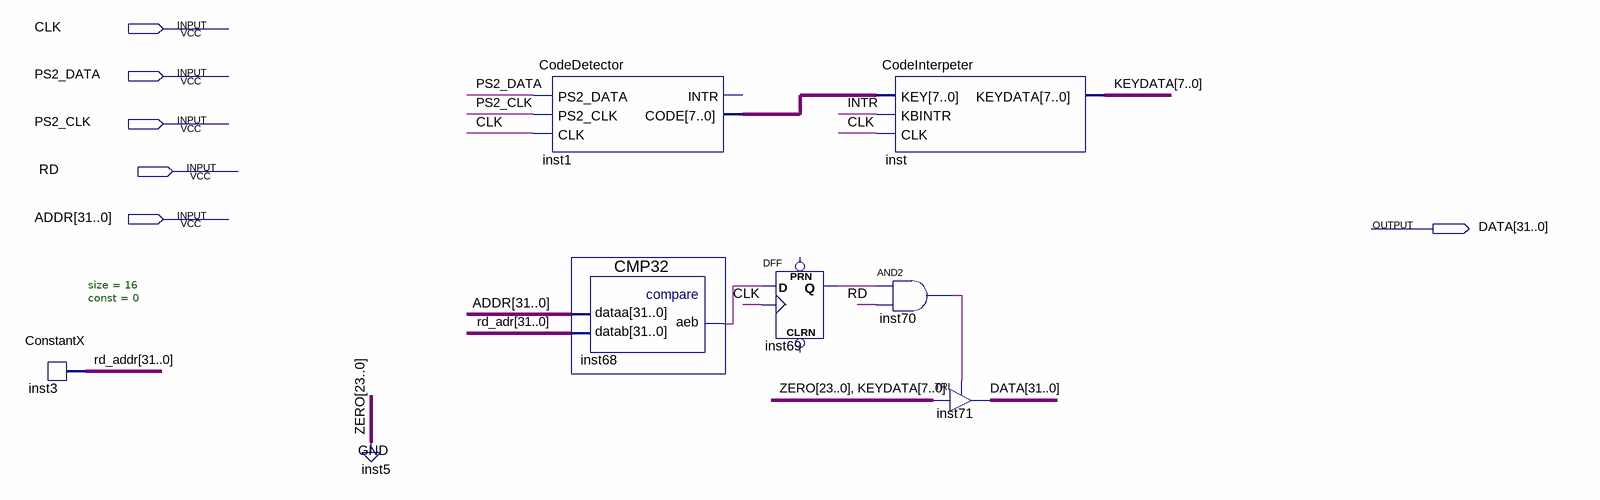
[diagram p0: schematic sheet]
// Quartus schematic KbController.bdf as structural Verilog: 7 symbols, 6 pins
module KbController (
  input  CLK,
  input  PS2_DATA,
  input  PS2_CLK,
  input  RD,
  input  [31:0] ADDR,
  output [31:0] DATA
);

  wire inst68_aeb, inst69_q, inst70_out, INTR;
  wire [7:0] inst1_code, KEYDATA;
  wire [31:0] rd_addr, rd_adr;

  ConstantX #(.size(16), .\const (0)) inst3 (.DATA_OUT(rd_addr));
  CodeDetector inst1 (.PS2_DATA(PS2_DATA), .PS2_CLK(PS2_CLK), .CLK(CLK), .CODE(inst1_code));  // open: INTR
  CMP32 inst68 (.dataa(ADDR), .datab(rd_adr), .aeb(inst68_aeb));
  DFF inst69 (.CLK(CLK), .D(inst68_aeb), .Q(inst69_q));  // open: CLRN, PRN
  CodeInterpeter inst (.KEY(inst1_code), .KBINTR(INTR), .CLK(CLK), .KEYDATA(KEYDATA));
  and inst70 (inst70_out, inst69_q, RD);
  TRI inst71[31:0] (.IN({{24{1'b0}}, KEYDATA}), .OE(inst70_out), .OUT(DATA));
endmodule
